# Altium schematic sheet MCUs_STM32.SchDoc
size A3; SheetNumber: 3; SheetTotal: 3
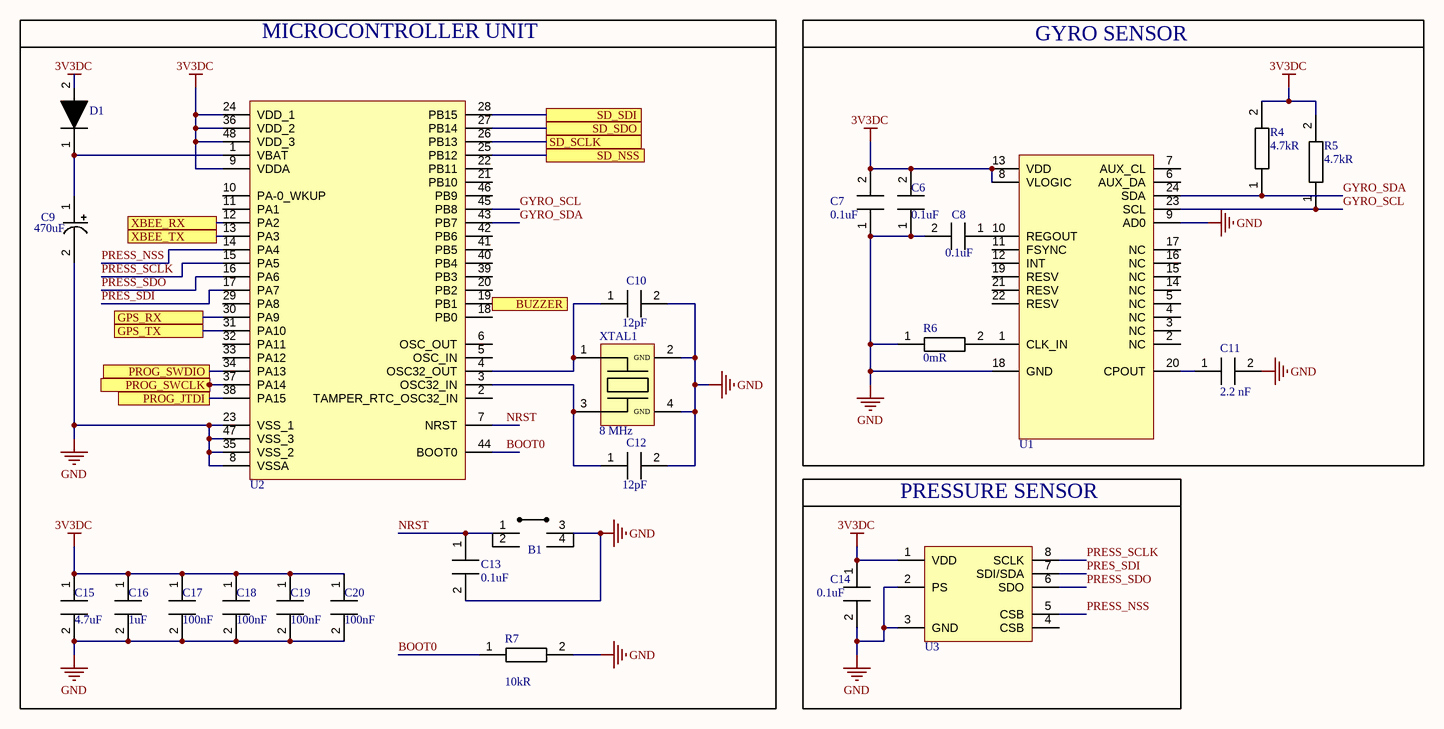
[diagram p0: MCUs_STM32.SchDoc]

## Parts
B1  B_D6R90 F1 LFS  [PBUTTON_OFFMOM]  (value not drawn)
C6  value 0.1uF  [CAP_1206]  (hidden comment: C1206C104K3RAC7800)
C7  value 0.1uF  [CAP_1206]  (hidden comment: C1206C104K3RAC7800)
C8  value 0.1uF  [CAP_1206]  (hidden comment: C1206C104K3RAC7800)
C9  value 470uF  [CAP_RADIAL_D10_P5]  (hidden comment: ESH477M050AH4AA)
C10  value 12pF  [CAP_1206]  (hidden comment: C1206C120J5GAC7800)
C11  value 2.2 nF  [CAP_1206]  (hidden comment: CC1206KRX7R9BB222)
C12  value 12pF  [CAP_1206]  (hidden comment: C1206C120J5GAC7800)
C13  value 0.1uF  [CAP_1206]  (hidden comment: C1206C104K3RAC7800)
C14  value 0.1uF  [CAP_1206]  (hidden comment: C1206C104K3RAC7800)
C15  value 4.7uF  [CAP_0805]  (hidden comment: CL21A475KAQNNNE)
C16  value 1uF  [CAP_0805]  (hidden comment: CL21B105KBFNNNE)
C17  Capacitance: 100nF  [CAP_0805]  (hidden comment: CL21B104KBCNNNC)
C18  Capacitance: 100nF  [CAP_0805]  (hidden comment: CL21B104KBCNNNC)
C19  Capacitance: 100nF  [CAP_0805]  (hidden comment: CL21B104KBCNNNC)
C20  Capacitance: 100nF  [CAP_0805]  (hidden comment: CL21B104KBCNNNC)
D1  1N4148WS  [SOD_323_F]  (value not drawn)
R4  value 4.7kR  [RE_1206]  (hidden comment: RC1206FR-074K7L)
R5  value 4.7kR  [RE_1206]  (hidden comment: RC1206FR-074K7L)
R6  value 0mR  [RE_0603]  (hidden comment: RC0603JR-070RL)
R7  value 10kR  [RE_1206]  (hidden comment: RC1206FR-0710KL)
U1  MPU6050  [QFN_24]  (value not drawn)
U2  STM32F103C8T6  [LQGP48-STM]  (value not drawn)
U3  MS560702BA03-50  [8-SMD_MS560702BA03]  (value not drawn)
XTAL1  value 8 MHz  [4-SMD, No Lead]  (hidden comment: ECS-80-10-30B-CKM-TR)

## Blocks framed on the sheet
MICROCONTROLLER UNIT: B1 C9 C10 C12 C13 C15-C20 D1 R7 U2 XTAL1
GYRO SENSOR: C6-C8 C11 R4-R6 U1
PRESSURE SENSOR: C14 U3

## Ports
BUZZER (see STM32[4B]), GPS_RX (see STM32[3A]), GPS_TX (see STM32[3A]), PROG_JTDI (see STM32[2B]), PROG_SWCLK (see STM32[2B]), PROG_SWDIO (see STM32[2B]), SD_NSS (see STM32[5A]), SD_SCLK (see STM32[5A]), SD_SDI (see STM32[5A]), SD_SDO (see STM32[5A]), XBEE_RX (see STM32[2B]), XBEE_TX (see STM32[2B])

## Nets
3V3DC: C6.2 C7.2 C14.1 C15.1 C16.1 C17.1 C18.1 C19.1 C20.1 D1.2 R4.2 R5.2 U1.8(VLOGIC) U1.13(VDD) U2.9(VDDA) U2.24(VDD_1) U2.36(VDD_2) U2.48(VDD_3) U3.1(VDD)
GND: B1.3 C6.1 C7.1 C8.2 C9.2 C10.2 C11.2 C12.2 C13.2 C14.2 C15.2 C16.2 C17.2 C18.2 C19.2 C20.2 R6.1 R7.2 U1.9(AD0) U1.18(GND) U2.8(VSSA) U2.23(VSS_1) U2.35(VSS_2) U2.47(VSS_3) U3.2(PS) U3.3(GND) XTAL1.2(GND) XTAL1.4(GND)
BOOT0: R7.1 U2.44(BOOT0)
BUZZER: U2.19(PB1) ; port BUZZER
GPS_RX: U2.30(PA9) ; port GPS_RX
GPS_TX: U2.31(PA10) ; port GPS_TX
GYRO_SCL: R5.1 U1.23(SCL) U2.45(PB8)
GYRO_SDA: R4.1 U1.24(SDA) U2.43(PB7)
NRST: B1.1 C13.1 U2.7(NRST)
PRES_SDI: U2.17(PA7) U3.7(SDI/SDA)
PRESS_NSS: U2.14(PA4) U3.5(CSB)
PRESS_SCLK: U2.15(PA5) U3.8(SCLK)
PRESS_SDO: U2.16(PA6) U3.6(SDO)
PROG_JTDI: U2.38(PA15) ; port PROG_JTDI
PROG_SWCLK: U2.37(PA14) ; port PROG_SWCLK
PROG_SWDIO: U2.34(PA13) ; port PROG_SWDIO
SD_NSS: U2.25(PB12) ; port SD_NSS
SD_SCLK: U2.26(PB13) ; port SD_SCLK
SD_SDI: U2.28(PB15) ; port SD_SDI
SD_SDO: U2.27(PB14) ; port SD_SDO
XBEE_RX: U2.12(PA2) ; port XBEE_RX
XBEE_TX: U2.13(PA3) ; port XBEE_TX
NetC8_1: C8.1 U1.10(REGOUT)
NetC9_1: C9.1 D1.1 U2.1(VBAT)
NetC10_1: C10.1 U2.4(OSC32_OUT) XTAL1.1
NetC11_1: C11.1 U1.20(CPOUT)
NetC12_1: C12.1 U2.3(OSC32_IN) XTAL1.3
NetR6_2: R6.2 U1.1(CLK_IN)

Not connected (* = marked no-connect by the designer): B1 2 4; U1 2(NC) 3(NC) 4(NC) 5(NC) 6(AUX_DA) 7(AUX_CL) 11(FSYNC) 12(INT) 14(NC) 15(NC) 16(NC) 17(NC) 19(RESV) 21(RESV) 22(RESV); U2 2(TAMPER_RTC_OSC32_IN) 5(OSC_IN) 6(OSC_OUT) 10(PA-0_WKUP) 11(PA1) 18(PB0) 20(PB2) 21(PB10) 22(PB11) 29(PA8) 32(PA11) 33(PA12) 39(PB3) 40(PB4) 41(PB5) 42(PB6) 46(PB9); U3 4(CSB)

## Notes on the sheet
- Document Name
- Prepared By
- Company Name
- Checked By
- A. Can KARACAN
- Release Date
- Department
- R&D- Hardware
- Size
- Change Date
- A3
- Approved By
- Sheet
- /

## Library data of the parts
C6-C8 C13 C14 = CAP CER 0.1uF 1206: Multilayer Ceramic Capacitor, 0.1 uF, 25 V, ± 10%, X7R, 1206 [3216 Metric]; Manufacturer: KEMET; Manufacturer Part Number: C1206C104K3RACTU; Material: 4241ConductorMaterial; Voltage Rating: 25V; Dissipation Factor: 3.5%; Designed By: Ahmet Can; Supplier: Digi-Key; Supplier Part Number: 399-C1206C104K3RAC7800CT-ND; RoHS: Yes; Category: Ceramic Capacitors; Stock: 306395; Pricing: 1=0,1, 10=0,072, 50=0,0408, 100=0,0338, 500=0,02372, 1000=0,01963 (USD); Mounting Technology: Surface Mount; Case/Package: 1206; Case Code (Metric): 3216; Case Code (Imperial): 1206; Dielectric Material: Ceramic; Min Operating Temperature: -55°C; Max Operating Temperature: 125°C; Tolerance: 10%; Dielectric: X7R; Packaging: Cut Tape; Package Quantity: 4000; Voltage Rating (DC): 25V; Termination: SMD/SMT; Series: C; Construction: Flat; Length: 3.2mm; Width: 0.063inch; Height: 0.78mm; Depth: 1.6mm; Thickness: 0.035inch; Reach SVHC Compliant: No; RoHS Compliant: Yes; ComponentLink1URL: https://datasheet.ciiva.com/5416/kem-c1002-x7r-smd-5416282.pdf?src-supplier=Mouser; ComponentLink1Description: https://datasheet.ciiva.com/5416/kem-c1002-x7r-smd-5416282.pdf?src-supplier=Mouser
C9 = CAP ALU ELEC 470uF: Cap, 470UF, 50V, Alu Elec, Radial, Through Hole; Manufacturer: KEMET; Designed By: Ahmet Can; Lifetime @ Temp.: 2000 Hrs @ 105°C; Ripple Current @ Low Frequency: 630 mA @ 120 Hz; Ripple Current @ High Frequency: 945 mA @ 10 kHz; Polarization: Polar; Tolerance: ±20%; Supplier: Digi-Key; Supplier Part Number: 399-15683-ND; Manufacturer Part Number: ESH477M050AH4AA; RoHS: Yes; Stock: 6383; Pricing: 1=0,64, 10=0,455, 50=0,344, 100=0,2997, 500=0,222, 1000=0,1887, 2500=0,1776, 5000=0,1665 (USD); ComponentLink1URL: https://api.kemet.com/component-edge/download/datasheet/ESH477M050AH4AA.pdf?src-supplier=Digi-Key; ComponentLink1Description: https://api.kemet.com/component-edge/download/datasheet/ESH477M050AH4AA.pdf?src-supplier=Digi-Key; ComponentLink2URL: https://datasheet.octopart.com/ESH477M050AH4AA-KEMET-datasheet-130075338.pdf?src-supplier=Newark; ComponentLink2Description: https://datasheet.octopart.com/ESH477M050AH4AA-KEMET-datasheet-130075338.pdf?src-supplier=Newark; Category: Aluminum Electrolytic Capacitors; Case/Package: TH, Radial, Can; Mounting Type: Through Hole; Voltage Rating: 50V; Min Operating Temperature: -40°C; Max Operating Temperature: 105°C
C10 C12 = CAP CER 12pF 1206: Multilayer Ceramic Capacitor, 12 pF, 50 V, ± 5%, C0G (NP0), 1206 [3216 Metric]; Manufacturer: KEMET; Manufacturer Part Number: C1206C120J5GACTU; Material: 4241ConductorMaterial; Voltage Rating: 50V; Dissipation Factor: 0.1%; Temperature Coefficient: 30ppm/°C; Designed By: Ahmet Can; Supplier: Digi-Key; Supplier Part Number: 399-C1206C120J5GAC7800CT-ND; RoHS: Yes; Category: Ceramic Capacitors; Stock: 15852; Pricing: 1=0,2, 10=0,14, 50=0,0838, 100=0,0708, 500=0,04842, 1000=0,04284 (USD); Mounting Technology: Surface Mount,PCB; Case/Package: 1206; Case Code (Metric): 3216; Case Code (Imperial): 1206; Weight: 0.000571oz; Dielectric Material: Ceramic; Min Operating Temperature: -55°C; Max Operating Temperature: 125°C; Tolerance: 5%; Dielectric: C0G; Packaging: Tape and Reel; Voltage Rating (DC): 50V; Termination: SMD/SMT; Voltage: 50V; Series: SMD Comm C0G; Construction: Flat; Length: 3.2mm; Width: 1.6mm; Height: 0.78mm; Depth: 1.6mm; Reach SVHC Compliant: No; Lead Free: Lead Free; RoHS Compliant: Yes; ComponentLink1URL: https://datasheet.ciiva.com/7730/1732697-7730097.pdf?src-supplier=Element14; ComponentLink1Description: https://datasheet.ciiva.com/7730/1732697-7730097.pdf?src-supplier=Element14; ComponentLink2URL: https://datasheet.ciiva.com/145/docfinderpartnumber-c1206c120j5gactu-145627.pdf?src-supplier=Digi-Key; ComponentLink2Description: https://datasheet.ciiva.com/145/docfinderpartnumber-c1206c120j5gactu-145627.pdf?src-supplier=Digi-Key; ComponentLink3URL: https://datasheet.ciiva.com/14595/70095383-14595525.pdf?src-supplier=Allied+Electronics; ComponentLink3Description: https://datasheet.ciiva.com/14595/70095383-14595525.pdf?src-supplier=Allied+Electronics; ComponentLink4URL: https://datasheet.ciiva.com/14604/70095383-14604488.pdf?src-supplier=Allied+Electronics; ComponentLink4Description: https://datasheet.ciiva.com/14604/70095383-14604488.pdf?src-supplier=Allied+Electronics
C11 = CAP CER 2.2 nF 1206: CAP CER 2200PF 50V X7R 1206; Manufacturer: Yageo; Supplier: Digi-Key; Supplier Part Number: 311-1171-1-ND; Manufacturer Part Number: CC1206KRX7R9BB222; RoHS: Yes; Category: Ceramic Capacitors; Stock: 22858; Pricing: 1=0,21, 10=0,145, 50=0,087, 100=0,0735, 500=0,05026, 1000=0,04446 (USD); ComponentLink1URL: https://datasheet.ciiva.com/29148/445097-da-01-en-kerko-chip-1206-x7r-2200pf-10proz-50vg-29148910.pdf?src-supplier=Conrad; ComponentLink1Description: https://datasheet.ciiva.com/29148/445097-da-01-en-kerko-chip-1206-x7r-2200pf-10proz-50vg-29148910.pdf?src-supplier=Conrad; ComponentLink2URL: https://datasheet.ciiva.com/26829/getdatasheetpartid-137961-26829676.pdf?src-supplier=Verical; ComponentLink2Description: https://datasheet.ciiva.com/26829/getdatasheetpartid-137961-26829676.pdf?src-supplier=Verical; ComponentLink3URL: https://datasheet.ciiva.com/145/mlccorderingcode-145128.pdf?src-supplier=Digi-Key; ComponentLink3Description: https://datasheet.ciiva.com/145/mlccorderingcode-145128.pdf?src-supplier=Digi-Key; ComponentLink4URL: https://datasheet.ciiva.com/145/mlccorderingcode-145129.pdf?src-supplier=Digi-Key; ComponentLink4Description: https://datasheet.ciiva.com/145/mlccorderingcode-145129.pdf?src-supplier=Digi-Key; ComponentLink5URL: https://datasheet.ciiva.com/145/mlccorderingcode-145130.pdf?src-supplier=Digi-Key; ComponentLink5Description: https://datasheet.ciiva.com/145/mlccorderingcode-145130.pdf?src-supplier=Digi-Key; ComponentLink6URL: https://datasheet.ciiva.com/11466/upy-gphc-x7r-6-3v-to-50v-8-11466764.pdf?src-supplier=Avnet; ComponentLink6Description: https://datasheet.ciiva.com/11466/upy-gphc-x7r-6-3v-to-50v-8-11466764.pdf?src-supplier=Avnet
C15 = CAP CER 4.7uF 0805: Multilayer Ceramic Capacitor, 4.7 uF, 25 V, ± 10%, X5R, 0805 [2012 Metric]; Manufacturer: Samsung; Material: 4241ConductorMaterial; Voltage Rating: 25V; Designed By: Ahmet Can; Supplier: Digi-Key; Supplier Part Number: 1276-1244-1-ND; Manufacturer Part Number: CL21A475KAQNNNE; RoHS: Yes; Category: Ceramic Capacitors; Stock: 3906800; Pricing: 1=0,1, 10=0,073, 50=0,0414, 100=0,0344, 500=0,02408, 1000=0,01994 (USD); Mounting Technology: Surface Mount; Case/Package: 0805; Case Code (Metric): 2012; Case Code (Imperial): 0805; Min Operating Temperature: -55°C; Max Operating Temperature: 85°C; Packaging: Tape and Reel; Tolerance: 10%; Dielectric: X5R; Voltage Rating (DC): 25V; Series: CL; Construction: Flat; Length: 2mm; Height: 1.25mm; Depth: 1.25mm; Radiation Hardening: No; Lead Free: Lead Free; RoHS Compliant: Yes; ComponentLink1URL: https://datasheet.ciiva.com/25798/cl21a475kaqnnne-25798882.pdf?src-supplier=Digi-Key; ComponentLink1Description: https://datasheet.ciiva.com/25798/cl21a475kaqnnne-25798882.pdf?src-supplier=Digi-Key
C16 = CAP CER 1uF 0805: CAP CER %10 1uF 0805; Manufacturer: Samsung; Material: 4241ConductorMaterial; Tolerance: 10%; Voltage Rating: 50V; Dielectric: X7R; Supplier: Digi-Key; Supplier Part Number: 1276-1029-1-ND; Manufacturer Part Number: CL21B105KBFNNNE; RoHS: Yes; Category: Ceramic Capacitors; Stock: 212507; Pricing: 1=0,11, 10=0,079, 50=0,045, 100=0,0373, 500=0,02616, 1000=0,02165 (USD); Mounting Technology: Surface Mount; Case/Package: 0805; Case Code (Metric): 2012; Case Code (Imperial): 0805; Min Operating Temperature: -55°C; Max Operating Temperature: 125°C; Packaging: Tape and Reel; Package Quantity: 1; Voltage: 50V; Series: CL; Construction: Flat; Voltage Rating (DC): 50V; Length: 2mm; Width: 0.049inch; Height: 1.25mm; Thickness: 0.053inch; Depth: 1.25mm; Radiation Hardening: No; RoHS Compliant: Yes; ComponentLink1URL: https://datasheet.ciiva.com/25800/cl21b105kbfnnne-25800291.pdf?src-supplier=Digi-Key; ComponentLink1Description: https://datasheet.ciiva.com/25800/cl21b105kbfnnne-25800291.pdf?src-supplier=Digi-Key; ComponentLink2URL: https://datasheet.ciiva.com/16449/cl21b105kbfnnne-16449003.pdf?src-supplier=Future+Electronics; ComponentLink2Description: https://datasheet.ciiva.com/16449/cl21b105kbfnnne-16449003.pdf?src-supplier=Future+Electronics
C17-C20 = CAP CER 100nF 0805: Multilayer Ceramic Capacitor, 0.1 uF, 50 V, ± 10%, X7R, 0805 [2012 Metric]; Manufacturer: Samsung; Voltage Rating: 50V; Supplier: Digi-Key; Supplier Part Number: 1276-1003-1-ND; Manufacturer Part Number: CL21B104KBCNNNC; RoHS: Yes; Category: Ceramic Capacitors; Stock: 1461740; Pricing: 1=0,1, 10=0,044, 50=0,024, 100=0,0196, 500=0,01404, 1000=0,01103 (USD); Mounting Technology: Surface Mount; Case/Package: 0805; Case Code (Metric): 2012; Case Code (Imperial): 0805; Material: Ceramic; Min Operating Temperature: -55°C; Max Operating Temperature: 125°C; Tolerance: 10%; Dielectric: X7R; Packaging: Tape and Reel; Voltage: 50V; Voltage Rating (DC): 50V; Series: CL; Construction: Flat; Length: 2mm; Width: 0.049inch; Height: 0.85mm; Depth: 1.25mm; Thickness: 0.037inch; Radiation Hardening: No; Lead Free: Lead Free; RoHS Compliant: Yes; ComponentLink1URL: https://datasheet.ciiva.com/25710/cl21b104kbcnnnc-25710182.pdf?src-supplier=Digi-Key; ComponentLink1Description: https://datasheet.ciiva.com/25710/cl21b104kbcnnnc-25710182.pdf?src-supplier=Digi-Key; ComponentLink2URL: https://datasheet.ciiva.com/29199/454152-da-01-en-vs-kondensator-0805-29199814.pdf?src-supplier=Conrad; ComponentLink2Description: https://datasheet.ciiva.com/29199/454152-da-01-en-vs-kondensator-0805-29199814.pdf?src-supplier=Conrad
D1 = DIO_1N4148WS: Diode Ultra Fast Recovery Rectifier 75V 0.15A 2-Pin SOD-323F T/R; Manufacturer: ON Semiconductor / Fairchild; Forward Current: 150mA; Max Forward Surge Current (Ifsm): 2A; Max Reverse Current: 5uA; Reverse Recovery Time: 4ns; Element Configuration: Single; Designed By: Ahmet Can; Supplier: Digi-Key; Supplier Part Number: 1N4148WSFSCT-ND; Manufacturer Part Number: 1N4148WS; RoHS: Yes; Category: Rectifier Diodes; Stock: 1299120; Pricing: 1=0,17, 10=0,159, 100=0,0867, 500=0,05332, 1000=0,03636 (USD); Mounting Technology: Surface Mount; Pins: 2; Weight: 0.0276g; Min Operating Temperature: -55°C; Max Operating Temperature: 150°C; Packaging: Tape and Reel; Max Repetitive Reverse Voltage (Vrrm): 75V; Average Rectified Current: 150mA; Max Reverse Voltage (DC): 75V; Series: -; Package Quantity: 1; Recovery Time: 4ns; Reverse Voltage: 75V; Length: 1.8mm; Width: 1.35mm; Height: 1mm; Radiation Hardening: No; RoHS Compliant: Yes; Reach SVHC Compliant: No; Lead Free: Lead Free; ComponentLink1URL: https://datasheet.ciiva.com/15208/getdatasheetpartid-127819-15208358.pdf?src-supplier=Verical; ComponentLink1Description: https://datasheet.ciiva.com/15208/getdatasheetpartid-127819-15208358.pdf?src-supplier=Verical; ComponentLink2URL: https://datasheet.ciiva.com/8300/1n914bws-8300360.pdf?src-supplier=Avnet; ComponentLink2Description: https://datasheet.ciiva.com/8300/1n914bws-8300360.pdf?src-supplier=Avnet; ComponentLink3URL: https://datasheet.ciiva.com/910/1n4148ws-910381.pdf?src-supplier=Digi-Key; ComponentLink3Description: https://datasheet.ciiva.com/910/1n4148ws-910381.pdf?src-supplier=Digi-Key; ComponentLink4URL: https://datasheet.ciiva.com/910/1n4148ws-910382.pdf?src-supplier=Digi-Key; ComponentLink4Description: https://datasheet.ciiva.com/910/1n4148ws-910382.pdf?src-supplier=Digi-Key
R4 R5 = RES 4K7 1206: SMD Chip Resistor, 4.7 kOhm, ± 1%, 250 mW, 1206 [3216 Metric], Thick Film, General Purpose; Manufacturer: Yageo; Voltage Rating (DC): 200V; Temperature Coefficient: 100ppm/°C; Power Rating: 250mW; Designed By: Ahmet Can; Supplier: Digi-Key; Supplier Part Number: 311-4.70KFRCT-ND; Manufacturer Part Number: RC1206FR-074K7L; RoHS: Yes; Category: Chip SMD Resistors; Stock: 2180352; Pricing: 1=0,1, 10=0,036, 50=0,0232, 100=0,0195, 500=0,01364, 1000=0,01187 (USD); Case/Package: 1206; Pins: 2; Case Code (Imperial): 1206; Case Code (Metric): 3216; Min Operating Temperature: -55°C; Max Operating Temperature: 155°C; Tolerance: 1%; Packaging: Tape and Reel; Resistor Type: Thick Film; Voltage Rating: 200V; Series: RC02H; Resistance Tolerance: 1%; Width: 1.6mm; Lead Free: Lead Free; Reach SVHC Compliant: Unknown; RoHS Compliant: Yes
R6 = RES 0K 0603: Zero Ohm Resistor, Jumper, 0603 [1608 Metric], Thick Film, 100 mW, 1 A, Surface Mount; Manufacturer: Yageo; Tolerance: 1%; Power Rating: 100mW; Voltage Rating (DC): 50V; Temperature Coefficient: 200ppm/°C; Resistance Tolerance: 5%; Designed By: Ahmet Can; Supplier: Digi-Key; Supplier Part Number: 311-0.0GRCT-ND; Manufacturer Part Number: RC0603JR-070RL; RoHS: Yes; Category: Chip SMD Resistors; Stock: 5815021; Pricing: 1=0,1, 10=0,016, 25=0,0112, 50=0,0086, 100=0,0063, 250=0,0048, 500=0,00386, 1000=0,00284 (USD); Case/Package: 0603; Pins: 2; Contact Plating: Tin,Matte; Case Code (Imperial): 0603; Case Code (Metric): 1608; Min Operating Temperature: -55°C; Max Operating Temperature: 155°C; Resistor Type: Thick Film; Packaging: Tape and Reel; Termination: SMD/SMT; Series: RC; Technology: THICK FILM; Package Quantity: 5000; Voltage Rating: 50V; Features: Moisture Resistant; Max Power Dissipation: 100mW; Number of Terminations: 2; Construction: Rectangular; Length: 1.6mm; Width: 0.8mm; Height: 0.45mm; Depth: 0.8mm; Lead Free: Lead Free; RoHS Compliant: Yes; Reach SVHC Compliant: Unknown; Military Standard: Not
R7 = RES 10K 1206: SMD Chip Resistor, 10 kOhm, ± 1%, 250 mW, 1206 [3216 Metric], Thick Film, General Purpose; Manufacturer: Yageo; Temperature Coefficient: 100ppm/°C; Power Rating: 250mW; Voltage Rating: 200V; Designed By: Ahmet Can; Supplier: Digi-Key; Supplier Part Number: 311-10.0KFRCT-ND; Manufacturer Part Number: RC1206FR-0710KL; RoHS: Yes; Category: Chip SMD Resistors; Stock: 3977916; Pricing: 1=0,1, 10=0,036, 50=0,0232, 100=0,0195, 500=0,01364, 1000=0,01187 (USD); Case/Package: 1206; Case Code (Imperial): 1206; Case Code (Metric): 3216; Min Operating Temperature: -55°C; Max Operating Temperature: 155°C; Tolerance: 1%; Packaging: Tape and Reel; Resistor Type: Thick Film; Package Quantity: 5000; Termination: SMD/SMT; Features: Moisture Resistant; Series: RC; Max Power Dissipation: 250mW; Number of Terminations: 2; Resistance Tolerance: 1%; Voltage Rating (AC): 200V; Length: 3.1mm; Width: 1.6mm; Height: 0.55mm; Lead Free: Lead Free; Reach SVHC Compliant: Unknown; RoHS Compliant: Yes; ComponentLink1URL: https://datasheet.ciiva.com/46445/444357-46445703.pdf?src-supplier=Element14; ComponentLink1Description: https://datasheet.ciiva.com/46445/444357-46445703.pdf?src-supplier=Element14; ComponentLink2URL: https://datasheet.ciiva.com/7857/1692832-7857244.pdf?src-supplier=Element14; ComponentLink2Description: https://datasheet.ciiva.com/7857/1692832-7857244.pdf?src-supplier=Element14; ComponentLink3URL: https://datasheet.ciiva.com/7857/1692832-7857245.pdf?src-supplier=Element14; ComponentLink3Description: https://datasheet.ciiva.com/7857/1692832-7857245.pdf?src-supplier=Element14
U1 = U_MPU6050: IMU ACCEL/GYRO 3-AXIS I2C 24QFN; Manufacturer: TDK InvenSense; Sensor Type: Accelerometer, Gyroscope, 6 Axis; Output Type: I²C; Designed By: Ahmet Can; Supplier: Digi-Key; Supplier Part Number: 1428-1007-1-ND; Manufacturer Part Number: MPU-6050; RoHS: Yes; Category: Inertial Measurement Units (IMUs); Stock: 40546; Pricing: 1=8,71, 10=6,969, 25=6,4464, 100=5,5752, 500=5,22676, 1000=4,8783 (USD); ComponentLink1URL: https://datasheet.ciiva.com/1513/1788002-1513632.pdf?src-supplier=Element14; ComponentLink1Description: https://datasheet.ciiva.com/1513/1788002-1513632.pdf?src-supplier=Element14; ComponentLink2URL: https://datasheet.ciiva.com/22731/1788002-22731434.pdf?src-supplier=Element14; ComponentLink2Description: https://datasheet.ciiva.com/22731/1788002-22731434.pdf?src-supplier=Element14; Min Operating Temperature: -40°C; Max Operating Temperature: 85°C
U2 = U_STM32F103C8T6: ARM Cortex-M3 STM32 F1 Microcontroller 32-Bit 72MHz 64kB FLASH LQFP48 STM32F103C8T6; Manufacturer: STMicroelectronics; RAM Size: 20KB; Interface: I2C,SPI,USB,CAN,USART; Number of I/Os: 37; Number of Timers/Counters: 3; Max Supply Voltage: 3.6V; Number of ADC Channels: 10; Min Supply Voltage: 2V; Data Bus Width: 32b; Nominal Supply Current: 1.7uA; Number of A/D Converters: 2NUMBER; Number of Channels: 10NUMBER; Designed By: Ahmet Can; Supplier: Digi-Key; Supplier Part Number: 497-6063-ND; Manufacturer Part Number: STM32F103C8T6; RoHS: Yes; Category: Microcontrollers; Stock: 3317; Pricing: 1=6,42, 25=5,5256, 100=4,7979, 500=4,17798, 2500=3,5672 (USD); Case/Package: LQFP; Pins: 48; Weight: 0.006349oz; Min Operating Temperature: -40°C; Max Operating Temperature: 85°C; Packaging: Tray; Package Quantity: 1500; Memory Format: FLASH; Clock Frequency: 72MHz; Memory Size: 64KB; Core Architecture: ARM; Series: STM32F103C8; Length: 7mm; Width: 7mm; Height: 1.4mm; Lead Free: Lead Free; RoHS Compliant: Yes; ComponentLink1URL: https://datasheet.ciiva.com/8054/1730126-8054942.pdf?src-supplier=Element14; ComponentLink1Description: https://datasheet.ciiva.com/8054/1730126-8054942.pdf?src-supplier=Element14; ComponentLink2URL: https://datasheet.ciiva.com/48687/001075658-da-01-en-mcu-64kb-mem-stm32f103c8t6-lqfp-48-stm-48687589.pdf?src-supplier=Conrad; ComponentLink2Description: https://datasheet.ciiva.com/48687/001075658-da-01-en-mcu-64kb-mem-stm32f103c8t6-lqfp-48-stm-48687589.pdf?src-supplier=Conrad
U3 = U_MS560702BA03-50: Board Mount Pressure Sensor 0.01bar to 1.2bar Absolute 8-Pin QFN T/R; Manufacturer: TE Connectivity; Operating Pressure: 0.15PSI ~ 17.4PSI (1kPa ~ 120kPa); Output Type: I²C, SPI; Supply Voltage: 1.8V ~ 3.6V; Designed By: Ahmet Can; Supplier: Digi-Key; Supplier Part Number: 223-1198-1-ND; Manufacturer Part Number: MS560702BA03-50; RoHS: Yes; Category: Pressure Sensors; Stock: 66297; Pricing: 1=10,86, 10=8,686, 25=8,0344, 100=6,9488, 500=6,5145, 1000=6,0802 (USD); ComponentLink1URL: http://www.farnell.com/datasheets/1756127.pdf?src-supplier=Farnell; ComponentLink1Description: http://www.farnell.com/datasheets/1756127.pdf?src-supplier=Farnell; ComponentLink2URL: https://datasheet.octopart.com/MS560702BA03-50-TE-Connectivity-datasheet-21074431.pdf?src-supplier=Element14; ComponentLink2Description: https://datasheet.octopart.com/MS560702BA03-50-TE-Connectivity-datasheet-21074431.pdf?src-supplier=Element14; ComponentLink3URL: https://www.te.com/commerce/DocumentDelivery/DDEController?Action=srchrtrv&DocNm=MS5607-02BA03&DocType=Data+Sheet&DocLang=English&src-supplier=Digi-Key; ComponentLink3Description: https://www.te.com/commerce/DocumentDelivery/DDEController?Action=srchrtrv&DocNm=MS5607-02BA03&DocType=Data+Sheet&DocLang=English&src-supplier=Digi-Key; ComponentLink4URL: https://datasheet.octopart.com/MS560702BA03-50-TE-Connectivity-datasheet-15137560.pdf?src-supplier=Future+Electronics; ComponentLink4Description: https://datasheet.octopart.com/MS560702BA03-50-TE-Connectivity-datasheet-15137560.pdf?src-supplier=Future+Electronics; ComponentLink5URL: https://datasheet.octopart.com/MS560702BA03-50-TE-Connectivity-datasheet-65793091.pdf?src-supplier=Sager+Electronics; ComponentLink5Description: https://datasheet.octopart.com/MS560702BA03-50-TE-Connectivity-datasheet-65793091.pdf?src-supplier=Sager+Electronics; ComponentLink6URL: https://datasheet.octopart.com/MS560702BA03-50-TE-Connectivity-datasheet-93687046.pdf?src-supplier=Master+Electronics; ComponentLink6Description: https://datasheet.octopart.com/MS560702BA03-50-TE-Connectivity-datasheet-93687046.pdf?src-supplier=Master+Electronics
XTAL1 = XTAL_CRYSTAL_8 MHz: 8 MHz ±10ppm Crystal 10pF 100 Ohms 4-SMD, No Lead; Manufacturer: ECS International; Supplier: Digi-Key; Supplier Part Number: 50-ECS-80-10-30B-CKM-CT-ND; Manufacturer Part Number: ECS-80-10-30B-CKM-TR; RoHS: No; Stock: 25024; Pricing: 1=0,66, 10=0,581, 50=0,5432, 100=0,48, 500=0,45474 (USD)